# Altium schematic sheet MSP430F5438A_Core_Board.SchDoc
size A4
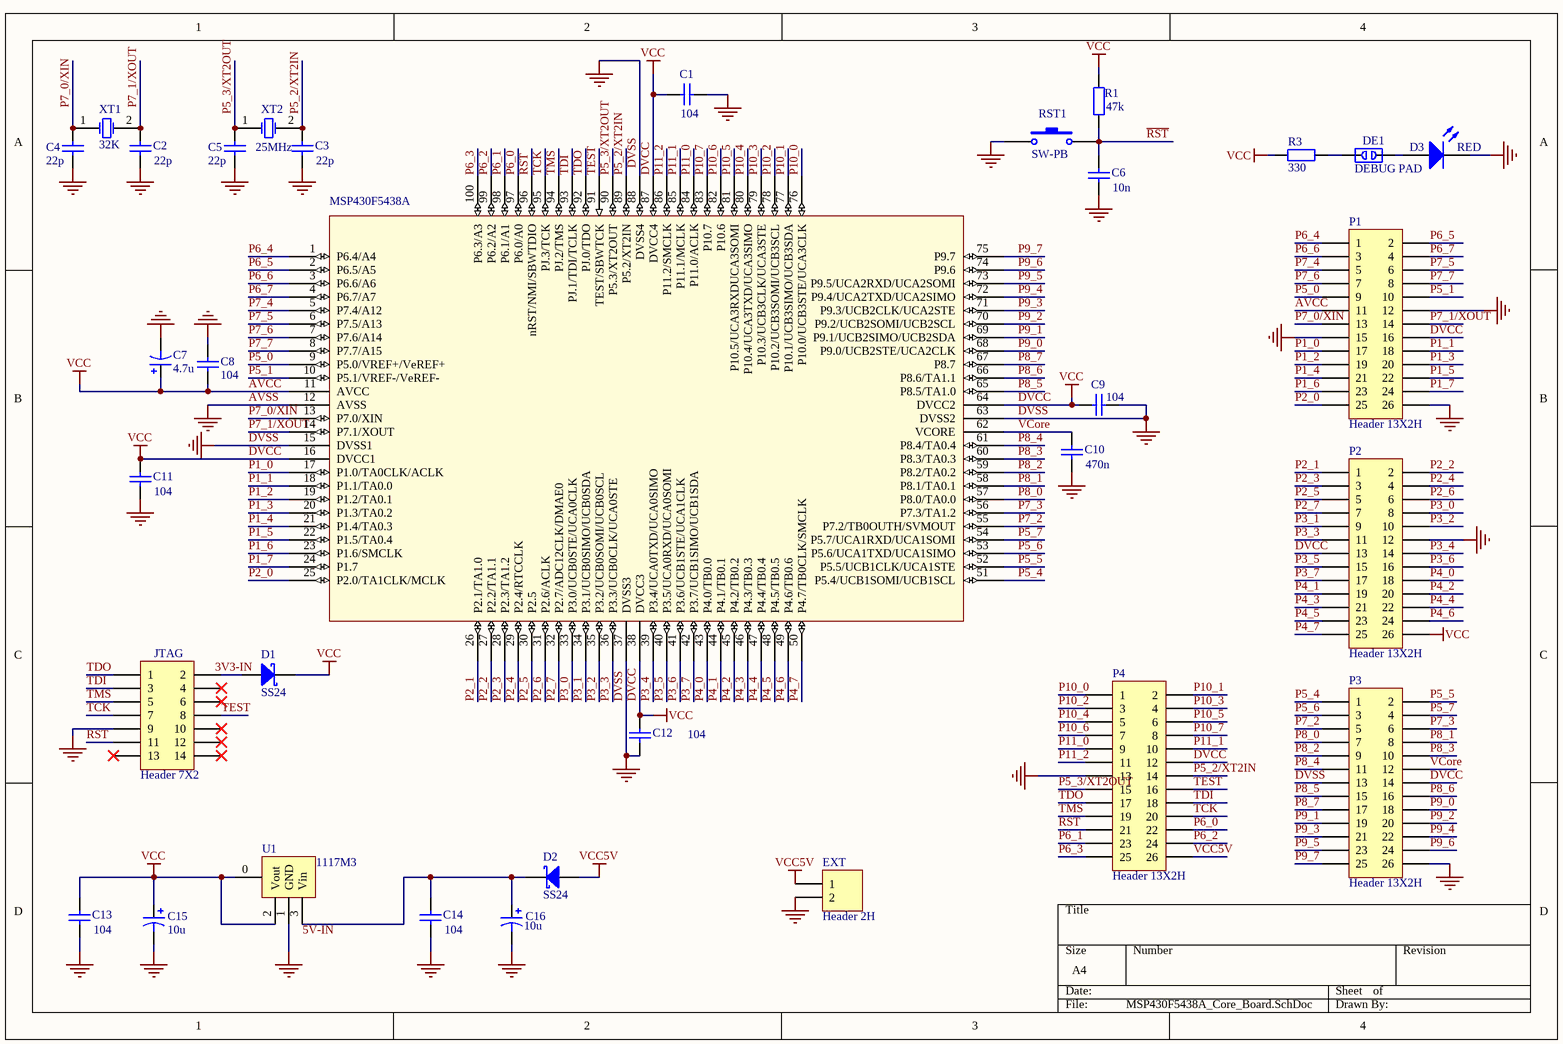
[diagram p0: MSP430F5438A_Core_Board.SchDoc]

## Parts
?  MSP430F5438A  [PZ100_M]
C1  104  [C0805]
C2  22p  [c0805]
C3  22p  [c0805]
C4  22p  [C0805]
C5  22p  [c0805]
C6  10n  [c0805]
C7  4.7u  [3216]
C8  104  [C0805]
C9  104  [C0805]
C10  470n  [c0805]
C11  104  [C0805]
C12  104  [C0805]
C13  104  [C0805]
C14  104  [C0805]
C15  10u  [3528]
C16  10u  [3528]
D1  SS24  [SMA]
D2  SS24  [SMA]
D3  RED  [Diode0805]
DE1  DEBUG PAD  [DEBUG_B]
EXT  Header 2H  [HDR1X2]
JTAG  Header 7X2  [DC-2.54-L-Z-14P]
P1  Header 13X2H  [HDR2X13]
P2  Header 13X2H  [HDR2X13]
P3  Header 13X2H  [HDR2X13]
P4  Header 13X2H  [HDR2X13]
R1  47k  [0805]
R3  330  [0805]
RST1  SW-PB  [BUTTON]
U1  1117M3  [SOT-223]
XT1  32K  [OSC-3x8-WS]
XT2  25MHz  [JZ-2]

## Nets
AVCC: ?.11(AVCC) ?.16(DVCC1) ?.38(DVCC3) ?.64(DVCC2) ?.87(DVCC4) C1.1 C7.1 C8.1 C9.1 C11.2 C12.1 C13.1 C15.1 D1.2(K) P1.11 P1.16 P2.13 P2.26 P3.14 P4.12 R1.2 R3.2 U1.0 U1.2(Vout)  [also labelled DVCC, VCC]
AVSS: ?.12(AVSS) ?.15(DVSS1) ?.37(DVSS3) ?.63(DVSS2) ?.88(DVSS4) C1.2 C2.1 C3.1 C4.1 C5.1 C6.2 C7.2 C8.2 C9.2 C10.2 C11.1 C12.2 C13.2 C14.2 C15.2 C16.2 D3.2(K) EXT.2 JTAG.9 P1.12 P1.15 P1.26 P2.12 P3.13 P3.26 P4.13 RST1.1 U1.1(GND)  [also labelled DVSS, GND]
VCC5V: D2.1(A) EXT.1 P4.26
P1_0: ?.17(P1.0/TA0CLK/ACLK) P1.17
P1_1: ?.18(P1.1/TA0.0) P1.18
P1_2: ?.19(P1.2/TA0.1) P1.19
P1_3: ?.20(P1.3/TA0.2) P1.20
P1_4: ?.21(P1.4/TA0.3) P1.21
P1_5: ?.22(P1.5/TA0.4) P1.22
P1_6: ?.23(P1.6/SMCLK) P1.23
P1_7: ?.24(P1.7) P1.24
P2_0: ?.25(P2.0/TA1CLK/MCLK) P1.25
P2_1: ?.26(P2.1/TA1.0) P2.1
P2_2: ?.27(P2.2/TA1.1) P2.2
P2_3: ?.28(P2.3/TA1.2) P2.3
P2_4: ?.29(P2.4/RTCCLK) P2.4
P2_5: ?.30(P2.5) P2.5
P2_6: ?.31(P2.6/ACLK) P2.6
P2_7: ?.32(P2.7/ADC12CLK/DMAE0) P2.7
P3_0: ?.33(P3.0/UCB0STE/UCA0CLK) P2.8
P3_1: ?.34(P3.1/UCB0SIMO/UCB0SDA) P2.9
P3_2: ?.35(P3.2/UCB0SOMI/UCB0SCL) P2.10
P3_3: ?.36(P3.3/UCB0CLK/UCA0STE) P2.11
P3_4: ?.39(P3.4/UCA0TXD/UCA0SIMO) P2.14
P3_5: ?.40(P3.5/UCA0RXD/UCA0SOMI) P2.15
P3_6: ?.41(P3.6/UCB1STE/UCA1CLK) P2.16
P3_7: ?.42(P3.7/UCB1SIMO/UCB1SDA) P2.17
P4_0: ?.43(P4.0/TB0.0) P2.18
P4_1: ?.44(P4.1/TB0.1) P2.19
P4_2: ?.45(P4.2/TB0.2) P2.20
P4_3: ?.46(P4.3/TB0.3) P2.21
P4_4: ?.47(P4.4/TB0.4) P2.22
P4_5: ?.48(P4.5/TB0.5) P2.23
P4_6: ?.49(P4.6/TB0.6) P2.24
P4_7: ?.50(P4.7/TB0CLK/SMCLK) P2.25
P5_0: ?.9(P5.0/VREF+/VeREF+) P1.9
P5_1: ?.10(P5.1/VREF-/VeREF-) P1.10
P5_2/XT2IN: ?.89(P5.2/XT2IN) C3.2 P4.14 XT2.2(OSC2)
P5_3/XT2OUT: ?.90(P5.3/XT2OUT) C5.2 P4.15 XT2.1(OSC1)
P5_4: ?.51(P5.4/UCB1SOMI/UCB1SCL) P3.1
P5_5: ?.52(P5.5/UCB1CLK/UCA1STE) P3.2
P5_6: ?.53(P5.6/UCA1TXD/UCA1SIMO) P3.3
P5_7: ?.54(P5.7/UCA1RXD/UCA1SOMI) P3.4
P6_0: ?.97(P6.0/A0) P4.22
P6_1: ?.98(P6.1/A1) P4.23
P6_2: ?.99(P6.2/A2) P4.24
P6_3: ?.100(P6.3/A3) P4.25
P6_4: ?.1(P6.4/A4) P1.1
P6_5: ?.2(P6.5/A5) P1.2
P6_6: ?.3(P6.6/A6) P1.3
P6_7: ?.4(P6.7/A7) P1.4
P7_0/XIN: ?.13(P7.0/XIN) C4.2 P1.13 XT1.1(OSC1)
P7_1/XOUT: ?.14(P7.1/XOUT) C2.2 P1.14 XT1.2(OSC2)
P7_2: ?.55(P7.2/TB0OUTH/SVMOUT) P3.5
P7_3: ?.56(P7.3/TA1.2) P3.6
P7_4: ?.5(P7.4/A12) P1.5
P7_5: ?.6(P7.5/A13) P1.6
P7_6: ?.7(P7.6/A14) P1.7
P7_7: ?.8(P7.7/A15) P1.8
P8_0: ?.57(P8.0/TA0.0) P3.7
P8_1: ?.58(P8.1/TA0.1) P3.8
P8_2: ?.59(P8.2/TA0.2) P3.9
P8_3: ?.60(P8.3/TA0.3) P3.10
P8_4: ?.61(P8.4/TA0.4) P3.11
P8_5: ?.65(P8.5/TA1.0) P3.15
P8_6: ?.66(P8.6/TA1.1) P3.16
P8_7: ?.67(P8.7) P3.17
P9_0: ?.68(P9.0/UCB2STE/UCA2CLK) P3.18
P9_1: ?.69(P9.1/UCB2SIMO/UCB2SDA) P3.19
P9_2: ?.70(P9.2/UCB2SOMI/UCB2SCL) P3.20
P9_3: ?.71(P9.3/UCB2CLK/UCA2STE) P3.21
P9_4: ?.72(P9.4/UCA2TXD/UCA2SIMO) P3.22
P9_5: ?.73(P9.5/UCA2RXD/UCA2SOMI) P3.23
P9_6: ?.74(P9.6) P3.24
P9_7: ?.75(P9.7) P3.25
P10_0: ?.76(P10.0/UCB3STE/UCA3CLK) P4.1
P10_1: ?.77(P10.1/UCB3SIMO/UCB3SDA) P4.2
P10_2: ?.78(P10.2/UCB3SOMI/UCB3SCL) P4.3
P10_3: ?.79(P10.3/UCB3CLK/UCA3STE) P4.4
P10_4: ?.80(P10.4/UCA3TXD/UCA3SIMO) P4.5
P10_5: ?.81(P10.5/UCA3RXDUCA3SOMI) P4.6
P10_6: ?.82(P10.6) P4.7
P10_7: ?.83(P10.7) P4.8
P11_0: ?.84(P11.0/ACLK) P4.9
P11_1: ?.85(P11.1/MCLK) P4.10
P11_2: ?.86(P11.2/SMCLK) P4.11
~{RST}: ?.96(nRST/NMI/SBWTDIO) C6.1 JTAG.11 P4.21 R1.1 RST1.2
TCK: ?.95(PJ.3/TCK) JTAG.7 P4.20
TDI: ?.93(PJ.1/TDI/TCLK) JTAG.3 P4.18
TDO: ?.92(PJ.0/TDO) JTAG.1 P4.17
TEST: ?.91(TEST/SBWTCK) JTAG.8 P4.16
TMS: ?.94(PJ.2/TMS) JTAG.5 P4.19
VCore: ?.62(VCORE) C10.1 P3.12
NetC14_1: C14.1 C16.1 D2.2(K) U1.3(Vin)
NetD1_1: D1.1(A) JTAG.2
NetD3_1: D3.1(A) DE1.2
NetDE1_1: DE1.1 R3.1

Not connected (* = marked no-connect by the designer): JTAG 4* 6* 10* 12* 13* 14*

## Notes on the sheet
- Labels drawn without touching a wire or pin: 3V3-IN, 5V-IN

## Library data of the parts
? = MSP430F5438IPZ
C1-C6 C8-C14 = Cap: Capacitor; Published: 8-Jun-2000; LatestRevisionDate: 17-Jul-2002; LatestRevisionNote: Re-released for DXP Platform.; PackageReference: RAD-0.3; Publisher: Altium Limited
  C1-C6 C8-C12: PackageDescription: Radial Cap, Thru-Hole; 2 Leads; 0.3 in Pin Spacing
C7 C15 C16 = Cap Pol1: Polarized Capacitor (Radial); pin to pad: 1>A 2>K; Published: 8-Jun-2000; LatestRevisionDate: 17-Jul-2002; LatestRevisionNote: Re-released for DXP Platform.; PackageReference: RB7.6-15; Publisher: Altium Limited; PackageDescription: Polarized Capacitor (Radial); 2 Leads
D1 D2 = SS24: 肖特基二极管; 淘宝ID: 小糖豆的小窝窝; BOM名称: 肖特基二极管; 下单链接: https://item.taobao.com/item.htm?ft=t&id=613637044352
D3 = LED0: Typical INFRARED GaAs LED; Published: 8-Jun-2000; LatestRevisionDate: 08-Jul-2005; LatestRevisionNote: Mech Layer 1 removed.; PackageReference: LED-0; Publisher: Altium Limited; PackageDescription: LED; 2 Leads
DE1 = DEBUG: 调试断点焊盘; 淘宝ID: 小糖豆的小窝窝; BOM名称: 调试断点焊盘; 下单链接: https://item.taobao.com/item.htm?ft=t&id=613637044352
EXT = Header 2H: Header, 2-Pin, Right Angle; LatestRevisionDate: 17-Jul-2002; LatestRevisionNote: Re-released for DXP Platform.; Publisher: Altium Limited
JTAG = Header 7X2: Header, 7-Pin, Dual row; LatestRevisionDate: 17-Jul-2002; LatestRevisionNote: Re-released for DXP Platform.; Publisher: Altium Limited
P1-P4 = Header 13X2H: Header, 13-Pin, Dual row, Right Angle; LatestRevisionDate: 17-Jul-2002; LatestRevisionNote: Re-released for DXP Platform.; Publisher: Altium Limited
R1 R3 = Res2: Resistor; Published: 8-Jun-2000; LatestRevisionDate: 17-Jul-2002; LatestRevisionNote: Re-released for DXP Platform.; PackageReference: AXIAL-0.4; Publisher: Altium Limited; PackageDescription: Axial Device, Thru-Hole; 2 Leads; 0.4 in Pin Spacing
RST1 = SW-PB: Switch; Published: 24-Mar-1999; LatestRevisionDate: 17-Jul-2002; LatestRevisionNote: Re-released for DXP Platform.; PackageReference: SPST-2; Publisher: Altium Limited; PackageDescription: Switch; 2 Leads
XT1 XT2 = XTAL: Crystal Oscillator; Published: 8-Jun-2000; LatestRevisionDate: 17-Jul-2002; LatestRevisionNote: Re-released for DXP Platform.; PackageReference: R38; Publisher: Altium Limited; PackageDescription: Crystal, Thru-Hole; 2 Leads; Body 3.1 x 8.2 mm (Dia.xH)